# EAGLE schematic BMP-Triangle (EAGLE 8.4.1)
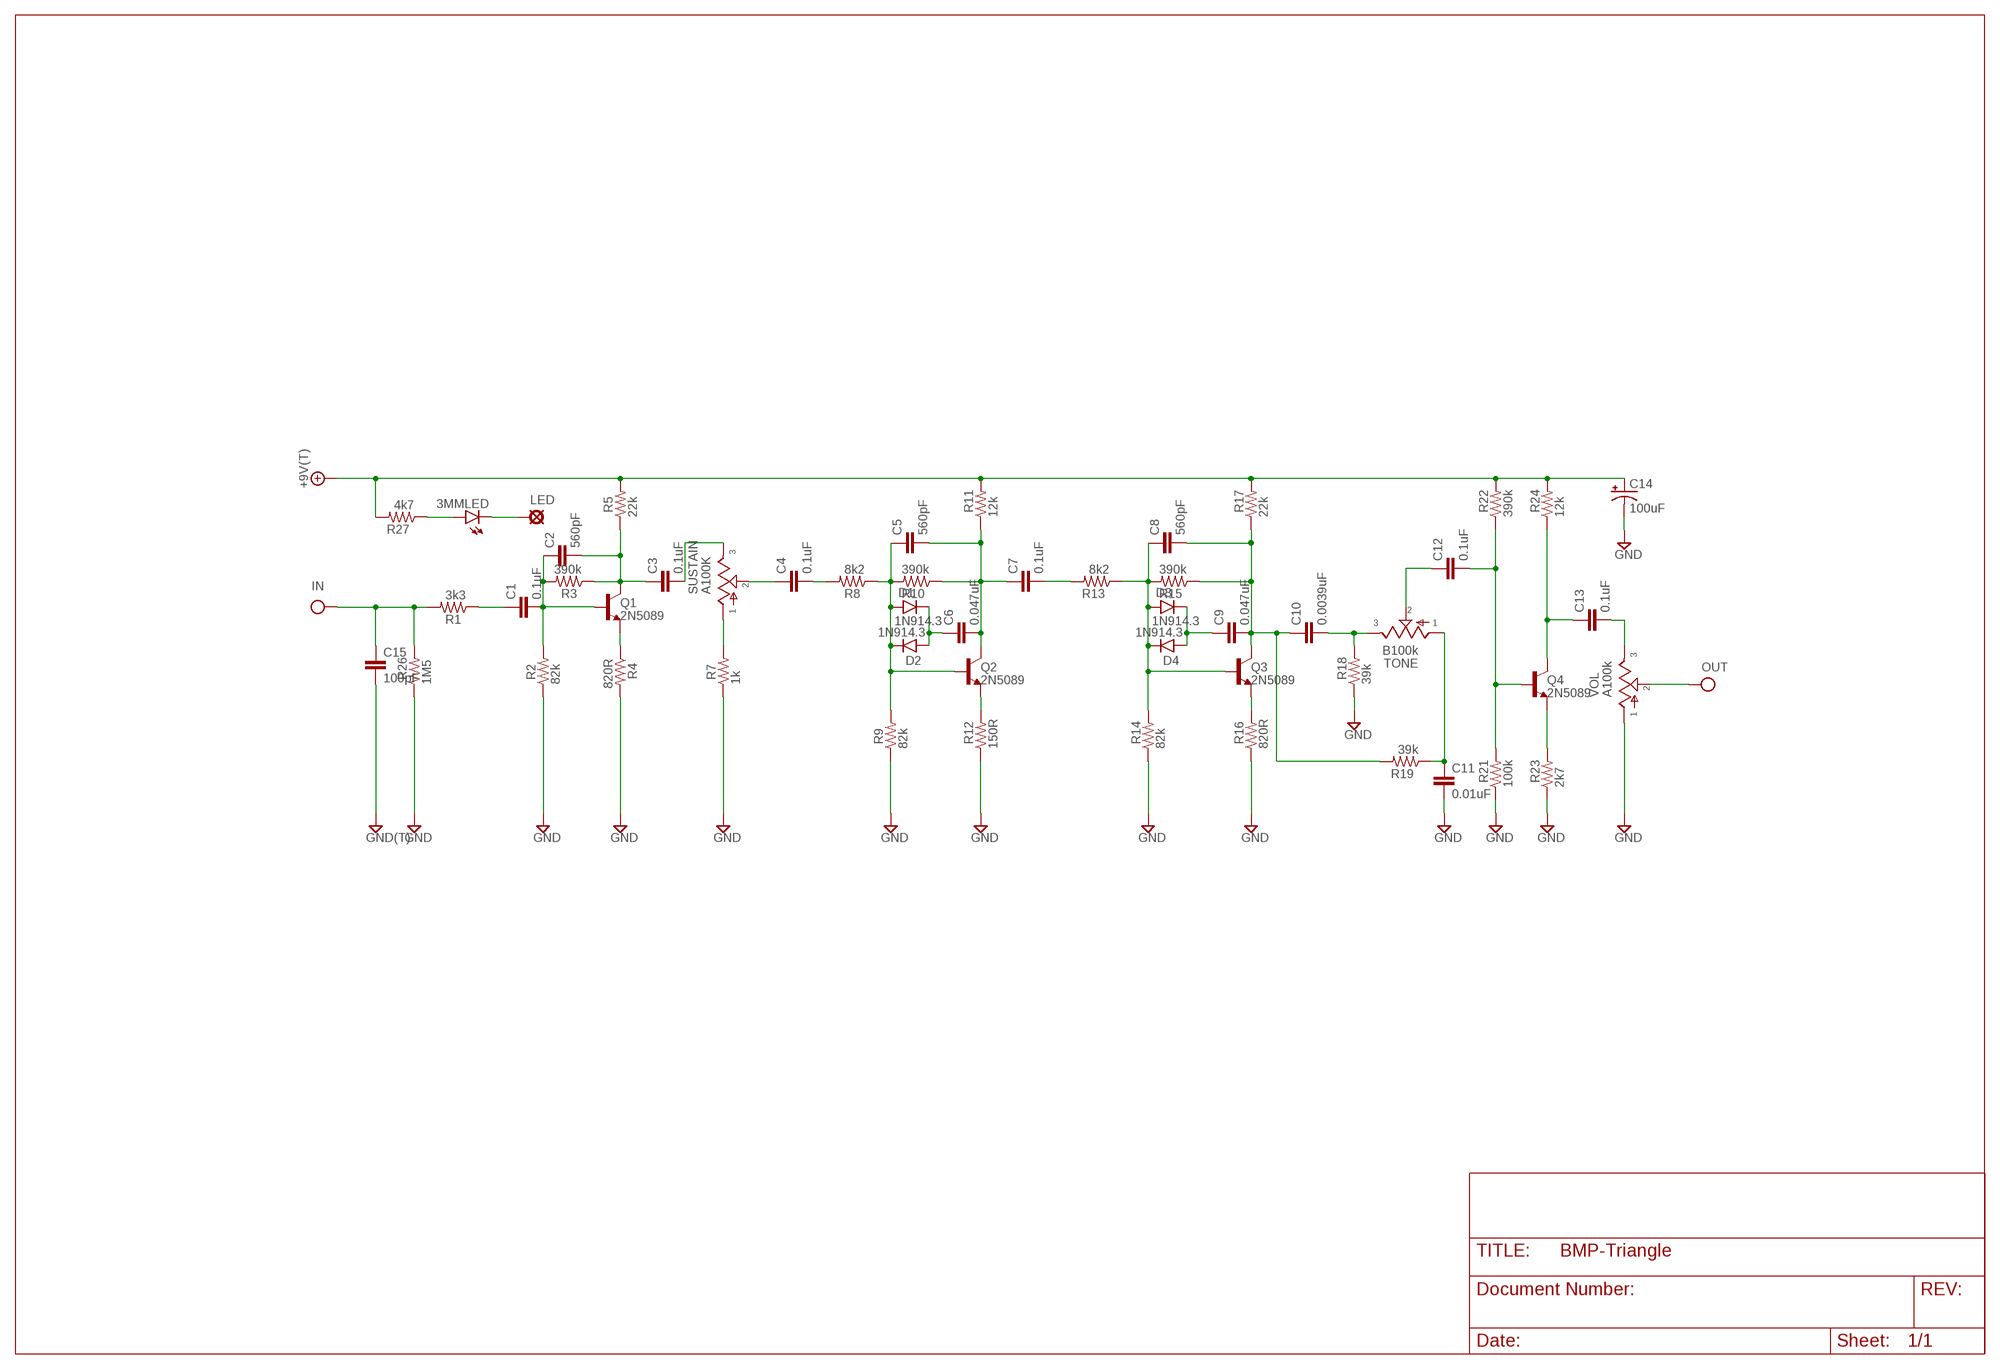
[diagram p0: schematic, sheet 1]

## Parts
3MMLED  LED3MM  [LED3MM]
+9V  +9V(T)  [SQUARE]
C1  0.1uF  075X0352  [075X035]
C2  560pF  050X030_0501  [050X030_050_1]
C3  0.1uF  075X0352  [075X035]
C4  0.1uF  075X0352  [075X035]
C5  560pF  050X030_0501  [050X030_050_1]
C6  0.047uF  075X0352  [075X035]
C7  0.1uF  075X0352  [075X035]
C8  560pF  050X030_0501  [050X030_050_1]
C9  0.047uF  075X0352  [075X035]
C10  0.0039uF  075X0352  [075X035]
C11  0.01uF  075X0352  [075X035]
C12  0.1uF  075X0352  [075X035]
C13  0.1uF  075X0352  [075X035]
C14  100uF  0631  [063_025]
C15  100pF  050X030_0501  [050X030_050_1]
D1  1N914.3  [DO35-3]
D2  1N914.3  [DO35-3]
D3  1N914.3  [DO35-3]
D4  1N914.3  [DO35-3]
G  GND(T)  [SQUARE]
IN  IN(T)  [SQUARE]
LED  PAD  [SQUARE]
OUT  OUT(T)  [SQUARE]
Q1  2N5089  [TO92-]
Q2  2N5089  [TO92-]
Q3  2N5089  [TO92-]
Q4  2N5089  [TO92-]
R1  3k3  6MM.3  [R0207/3]
R2  82k  6MM.3  [R0207/3]
R3  390k  6MM.3  [R0207/3]
R4  820R  6MM.3  [R0207/3]
R5  22k  6MM.3  [R0207/3]
R7  1k  6MM.3  [R0207/3]
R8  8k2  6MM.3  [R0207/3]
R9  82k  6MM.3  [R0207/3]
R10  390k  6MM.3  [R0207/3]
R11  12k  6MM.3  [R0207/3]
R12  150R  6MM.3  [R0207/3]
R13  8k2  6MM.3  [R0207/3]
R14  82k  6MM.3  [R0207/3]
R15  390k  6MM.3  [R0207/3]
R16  820R  6MM.3  [R0207/3]
R17  22k  6MM.3  [R0207/3]
R18  39k  6MM.3  [R0207/3]
R19  39k  6MM.3  [R0207/3]
R21  100k  6MM.3  [R0207/3]
R22  390k  6MM.3  [R0207/3]
R23  2k7  6MM.3  [R0207/3]
R24  12k  6MM.3  [R0207/3]
R26  1M5  6MM.3  [R0207/3]
R27  4k7  6MM.3  [R0207/3]
SUSTAIN  A100K  POT16MM_PCB_PADS  [16MM_PCB_PADS]
TONE  B100k  POT16MM_PCB_PADS  [16MM_PCB_PADS]
VOL  A100k  POT16MM_PCB_PADS  [16MM_PCB_PADS]

## Nets
+9V: +9V.1(+9V) C14.+ R5.2 R11.2 R17.2 R22.2 R24.2 R27.2
GND: C11.2 C14.- C15.2 G.1(GND) R2.1 R4.2 R7.1 R9.1 R12.1 R14.1 R16.1 R18.1 R21.1 R23.1 R26.1 VOL.1
IN: C15.1 IN.1(IN) R1.2 R26.2
N$1: C4.1 SUSTAIN.2
N$2: C1.1 R1.1
N$3: C1.2 C2.1 Q1.2(B) R2.2 R3.2
N$4: C2.2 C3.1 Q1.1(C) R3.1 R5.1
N$5: Q1.3(E) R4.1
N$6: C3.2 SUSTAIN.3
N$7: R7.2 SUSTAIN.1
N$8: C4.2 R8.2
N$9: C5.1 D1.A D2.C Q2.2(B) R8.1 R9.2 R10.2
N$10: C6.1 D1.C D2.A
N$11: C5.2 C6.2 C7.1 Q2.1(C) R10.1 R11.1
N$12: Q2.3(E) R12.2
N$13: C7.2 R13.2
N$14: C8.1 D3.A D4.C Q3.2(B) R13.1 R14.2 R15.2
N$15: Q3.3(E) R16.2
N$16: C8.2 C9.2 C10.1 Q3.1(C) R15.1 R17.1 R19.2
N$17: C9.1 D3.C D4.A
N$18: C10.2 R18.2 TONE.3
N$19: C11.1 R19.1 TONE.1
N$20: C12.1 TONE.2
N$21: C12.2 Q4.2(B) R21.2 R22.1
N$22: C13.1 Q4.1(C) R24.1
N$23: Q4.3(E) R23.2
N$24: C13.2 VOL.3
N$25: 3MMLED.A R27.1
N$26: 3MMLED.K(C) LED.1(PAD)
OUT: OUT.1(OUT) VOL.2

## Library data of the parts
3MMLED = mb_diodes:LED
+9V = mb_supply:+9V(T): +9V Voltage Supply use this to hook up +9v throughout a schematic instead of running wire automatically labels the net "+9v" adds a hookup pad to the circuit board
C1 C3 C4 C6 C7 C9-C13 = mb_caps-chicklet:075X035: 0.027 - 0.033uF Panasonic ECQ-B 7mm x 4mm 50 or 63V: 0.027 - 0.033uF;
C2 C5 C8 C15 = mb_caps-ceramic:050X030_050: 120 - 150pF Xicon Ceramic Disc 5mm lead spacing
C14 = mb_caps-electro:063: 33 - 220uF Xicon values at Mouser.com 10V: 220uF; 16V: 100uF; 25V: 100uF; 50V: 33uF
D1-D4 = mb_diodes:1N914: Fast Switching Diode DO-35 glass case a.k.a. 1N4148
G = mb_supply:GND(T): Ground use this to hook up ground (GND) throughout a schematic instead of running wire automatically labels the net "GND" adds a hookup pad to the circuit board (you can use several)
IN = mb_supply:IN(T): Input obsolete: use Pad instead and label net shematic input label with circuit board terminal/pad generally used only once on a schematic (because this device labels the net "IN" in the same way as a voltage supply or ground net)
LED = mb_supply:PAD: PAD use this package for pads with any purpose, including input, output, send or return various pad shapes: round, square, octogonal, long, and long offset
OUT = mb_supply:OUT(T): Output obsolete: use Pad instead and label net output label with circuit board terminal/pad usually appears only once on a schematic
Q1-Q4 = mb_trans:2N5089: NPN TRANSISTOR EBC pinout also works for 2N3565
R1-R5 R7-R19 R21-R24 R26 R27 = mb_resistors:6MM: 6mm Resistors Leads spaced 1-6 holes apart for 0.1" perfboard. Suitable for 1/4 watt resistors.
SUSTAIN TONE VOL = mb_pots:POT: Potentiometers the arrow indicates the clockwise motion of th wiper (lug 2) fully counter clockwise there is no resistance between lugs 1 and 2 fully clockwise the resistance between lugs 1 and 2 is the value of the pot